# EAGLE design PS (EAGLE 7.7.0)
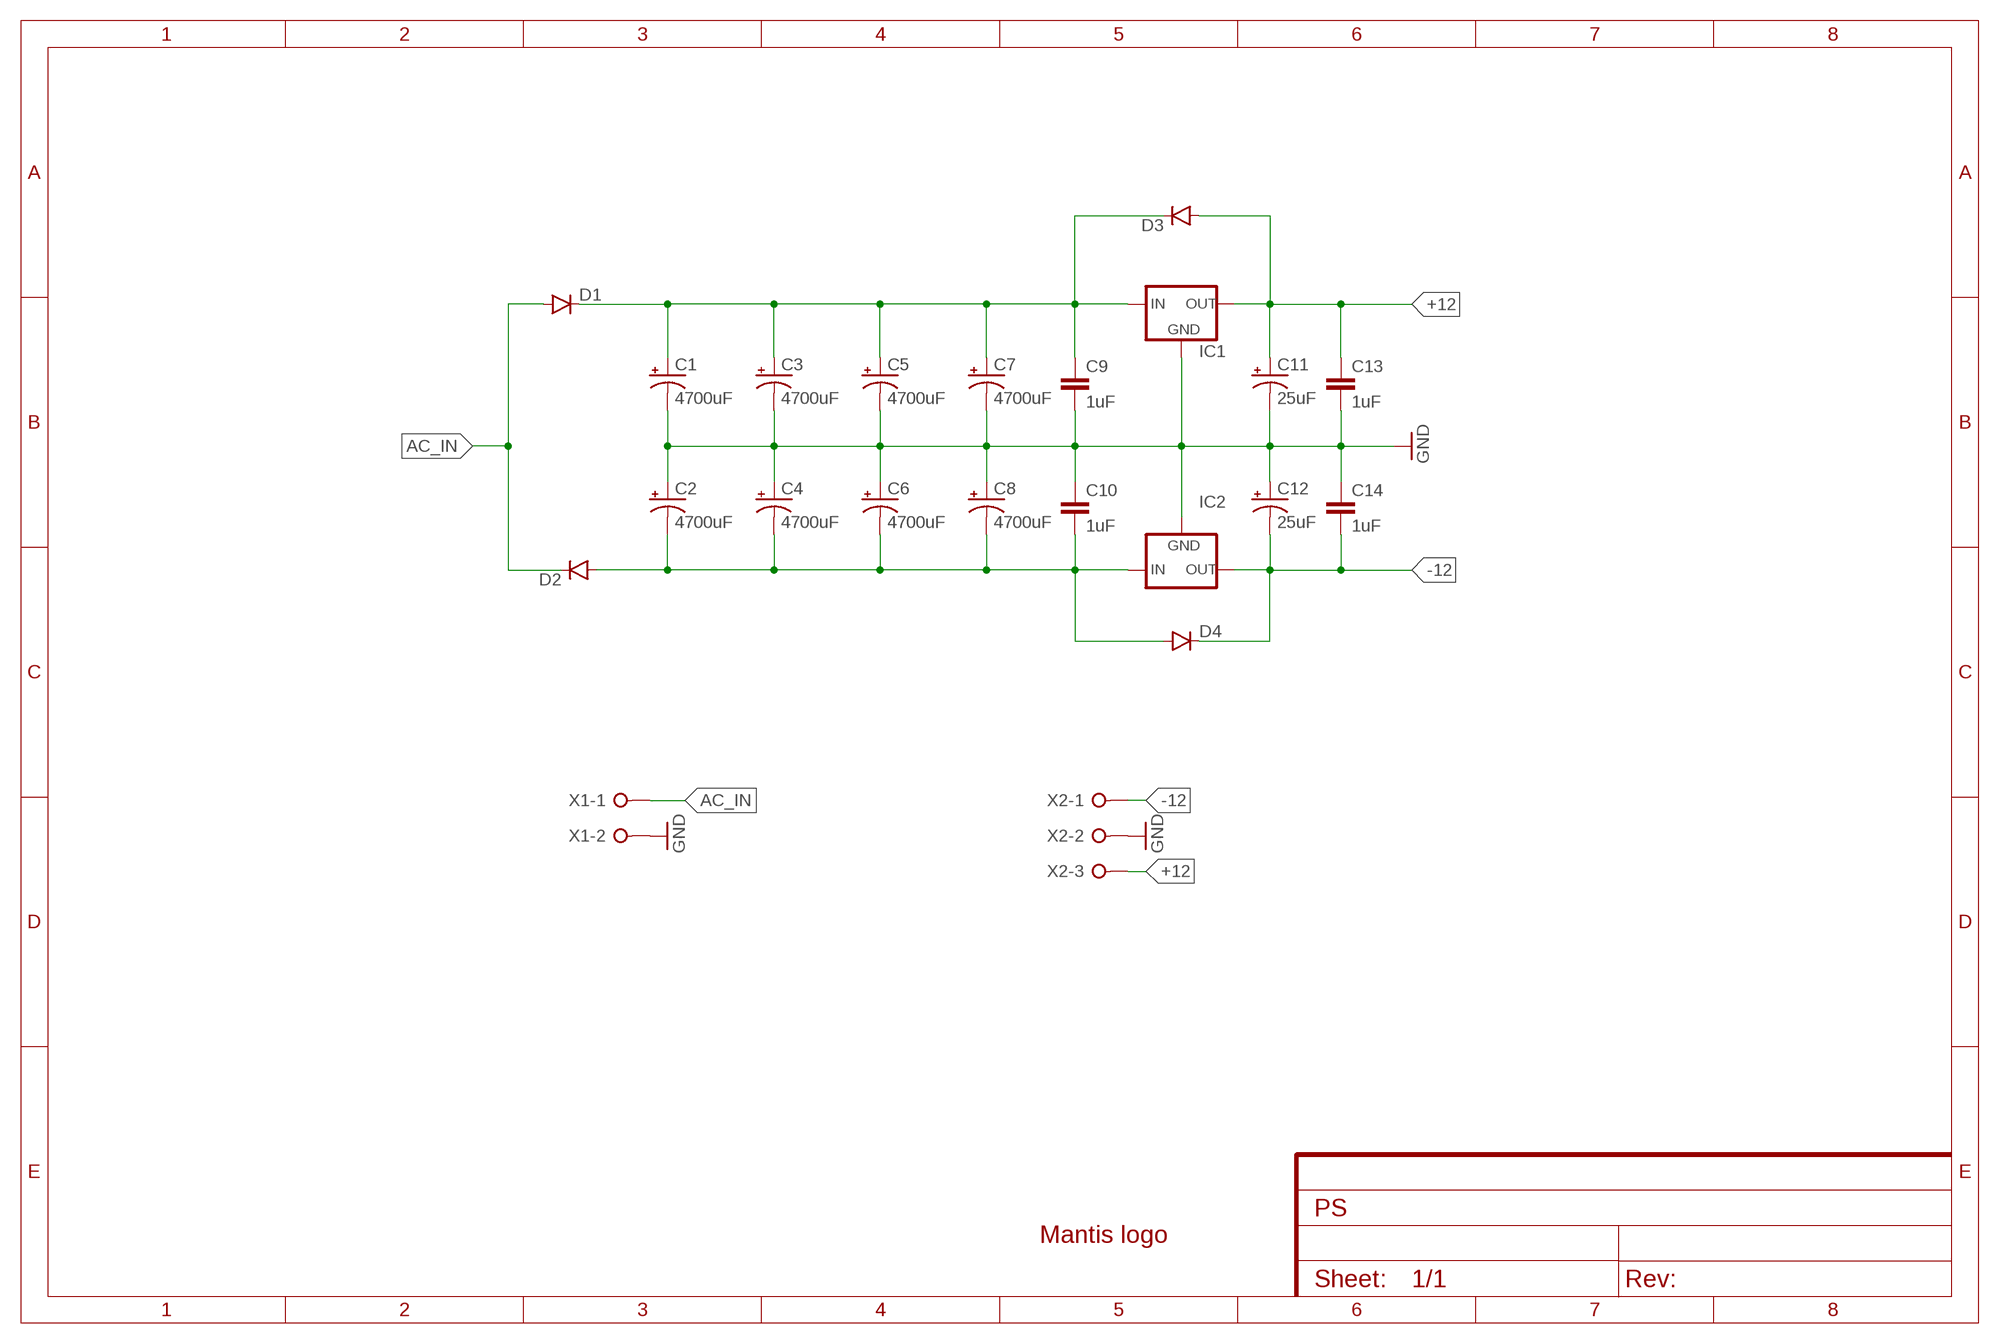
[diagram p0: schematic, sheet 1]

## Parts
C1  4700uF  CAP_POLPTH3  [CPOL-RADIAL-1000UF-63V]
C2  4700uF  CAP_POLPTH3  [CPOL-RADIAL-1000UF-63V]
C3  4700uF  CAP_POLPTH3  [CPOL-RADIAL-1000UF-63V]
C4  4700uF  CAP_POLPTH3  [CPOL-RADIAL-1000UF-63V]
C5  4700uF  CAP_POLPTH3  [CPOL-RADIAL-1000UF-63V]
C6  4700uF  CAP_POLPTH3  [CPOL-RADIAL-1000UF-63V]
C7  4700uF  CAP_POLPTH3  [CPOL-RADIAL-1000UF-63V]
C8  4700uF  CAP_POLPTH3  [CPOL-RADIAL-1000UF-63V]
C9  1uF  CAPPTH  [CAP-PTH-SMALL]
C10  1uF  CAPPTH  [CAP-PTH-SMALL]
C11  25uF  CAP_POLPTH2  [CPOL-RADIAL-10UF-25V]
C12  25uF  CAP_POLPTH2  [CPOL-RADIAL-10UF-25V]
C13  1uF  CAPPTH  [CAP-PTH-SMALL]
C14  1uF  CAPPTH  [CAP-PTH-SMALL]
D1  DIODEPTH  [DIODE-1N4001]
D2  DIODEPTH  [DIODE-1N4001]
D3  DIODEPTH  [DIODE-1N4001]
D4  DIODEPTH  [DIODE-1N4001]
IC1  78XXL  [78XXL]
IC2  79XXL  [79XXL]
LOGO1  LOGO-MANTIS  [LOGO-MANTIS]
X1  W237-02P  [W237-132]
X2  W237-3E  [W237-3E]

## Nets
+12: C11.1(+) C13.1 D3.A IC1.OUT X2.3
-12: C12.2(-) C14.2 D4.C IC2.OUT X2.1
AC_IN: D1.A D2.C X1.1
GND: C1.2(-) C2.1(+) C3.2(-) C4.1(+) C5.2(-) C6.1(+) C7.2(-) C8.1(+) C9.2 C10.1 C11.2(-) C12.1(+) C13.2 C14.1 IC1.GND IC2.GND X1.2 X2.2
R+: C1.1(+) C3.1(+) C5.1(+) C7.1(+) C9.1 D1.C D3.C IC1.IN
R-: C2.2(-) C4.2(-) C6.2(-) C8.2(-) C10.2 D2.A D4.A IC2.IN

## Library data of the parts
C1-C8 C11 C12 = SparkFun-Capacitors:CAP_POL: Capacitor Polarized These are standard SMD and PTH capacitors. Normally 10uF, 47uF, and 100uF in electrolytic and tantalum varieties. Always verify the external diameter of the through hole cap, it varies with capacity, voltage, and manufacturer. The EIA devices should be standard.
C9 C10 C13 C14 = SparkFun-Capacitors:CAP: Capacitor Standard 0603 ceramic capacitor, and 0.1" leaded capacitor.
D1-D4 = SparkFun-DiscreteSemi:DIODE: Diode These are standard reverse protection diodes and small signal diodes. SMA package can handle up to about 1A. SOD-323 can handle about 200mA. What the SOD-323 package when ordering, there are some mfgs out there that are 5-pin packages.
IC1 = v-reg:78XXL: VOLTAGE REGULATOR
IC2 = v-reg:79XXL: VOLTAGE REGULATOR
LOGO1 = my:LOGO-MANTIS: Mantis logo
X1 = con-wago-508:W237-02P: WAGO SREW CLAMP; OC_FARNELL: unknown; OC_NEWARK: unknown
X2 = con-wago-508:W237-3E: WAGO SREW CLAMP; OC_FARNELL: unknown; OC_NEWARK: unknown

## Board
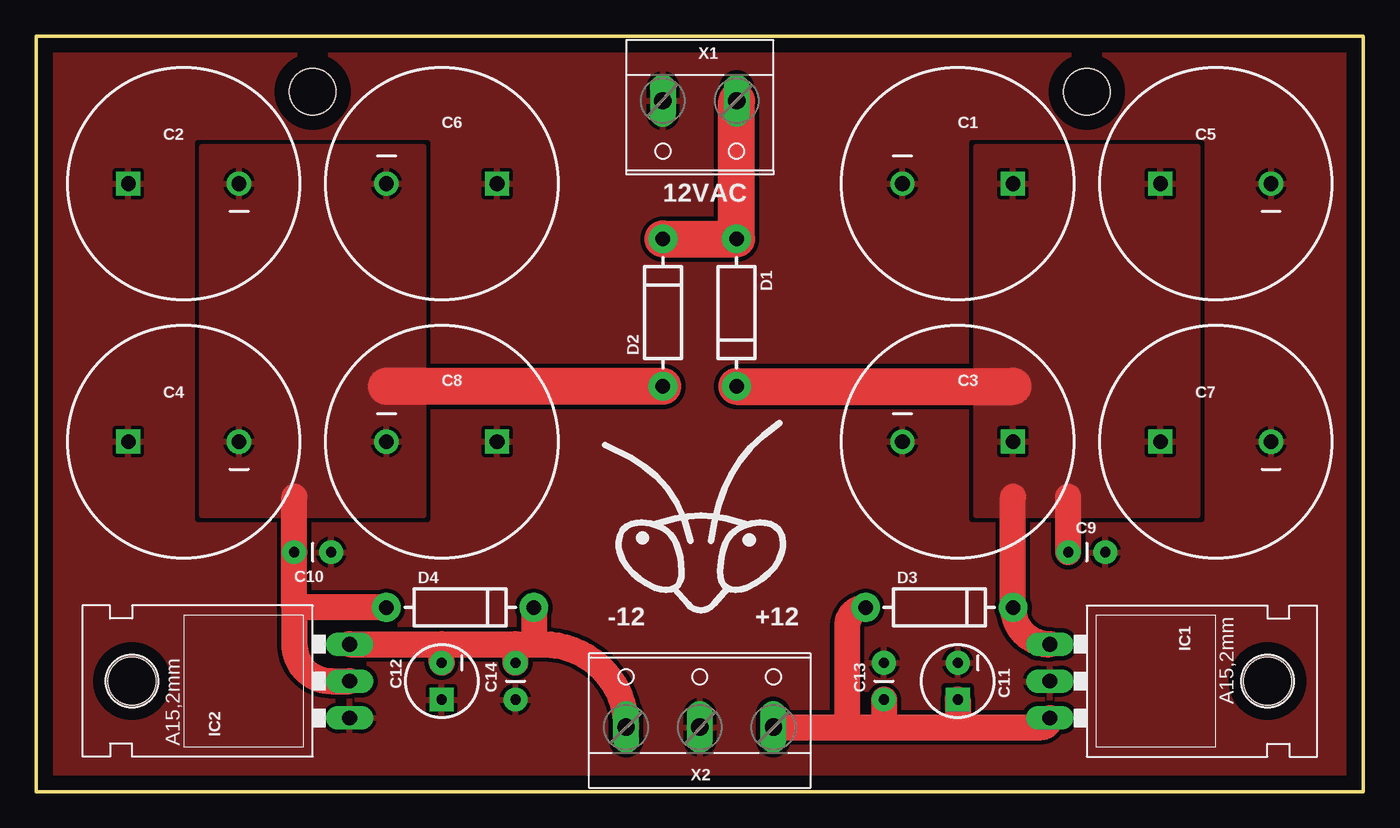
[diagram p1: board, top side]
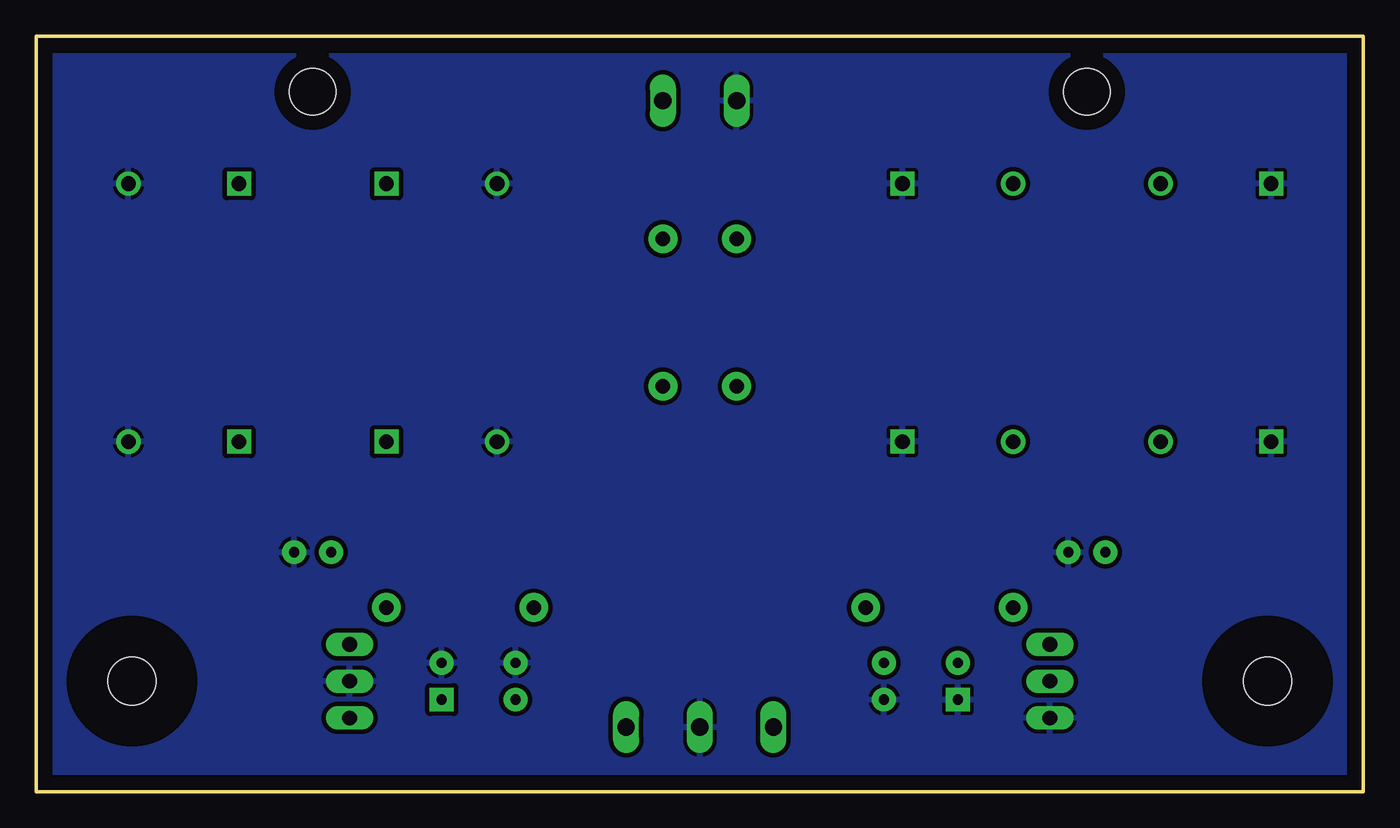
[diagram p2: board, bottom side, seen from below]

Size 91.44 x 52.07 mm. Coordinates in mm from the lower left corner, seen from the top.
Outline: 0,0 91.44,0 91.44,52.07 0,52.07 0,0
Copper layers (1*16): Top 0.035mm / dielectric 1.5mm / Bottom 0.035mm
Design rules "default *": minimum track width 12mil, minimum drill 22mil, track to track 12mil, track to pad 12mil, pad to pad 8mil, via to via 8mil, smd to smd 0mil, copper to edge 40mil, drill to drill 12mil, minimum pad ring 12mil, minimum via ring 10mil, stop-mask expansion 4mil, vias tented up to drill 0mil, thermal gap 10mil
Holes 3.2 mm at 19.05,48.26 72.39,48.26

### Footprints (pad centres in the part's own frame; a part is rotated, then mirrored left to right if it is on the bottom)
CPOL-RADIAL-1000UF-63V = drill 1.016 pad 1.651 square: 1 3.81,0 | drill 1.016 pad 1.676: 2 -3.81,0
CAP-PTH-SMALL = drill 0.7 pad 1.651: 1 0,0; 2 2.54,0
CPOL-RADIAL-10UF-25V = drill 0.7 pad 1.651 square: 1 1.27,0 | drill 0.7 pad 1.651: 2 -1.27,0
DIODE-1N4001 = drill 1 pad 1.981: A -5.08,0; C 5.08,0
78XXL = drill 1.016 long: GND 0,-3.81; IN -2.54,-3.81; OUT 2.54,-3.81 | hole 3.302: 0,11.176
79XXL = drill 1.016 long: GND -2.54,-3.81; IN 0,-3.81; OUT 2.54,-3.81 | hole 3.302: 0,11.176
W237-132 = drill 1.194 long: 1 -2.54,-0.635; 2 2.54,-0.635
W237-3E = drill 1.194 long: 1 -5.08,-0.635; 2 0,-0.635; 3 5.08,-0.635

### Placement (x,y rotation side)
C1  63.5,41.91 0 top
C2  10.16,41.91 180 top
C3  63.5,24.13 0 top
C4  10.16,24.13 180 top
C5  81.28,41.91 180 top
C6  27.94,41.91 0 top
C7  81.28,24.13 180 top
C8  27.94,24.13 0 top
C9  71.12,16.51 0 top
C10  20.32,16.51 180 top
C11  63.5,7.62 270 top
C12  27.94,7.62 270 top
C13  58.42,6.35 90 top
C14  33.02,6.35 90 top
D1  48.26,33.02 270 top
D2  43.18,33.02 90 top
D3  62.23,12.7 0 top
D4  29.21,12.7 0 top
IC1  73.66,7.62 270 top
IC2  17.78,7.62 90 top
LOGO1  45.72,19.05 0 top
X1  45.72,46.99 180 top
X2  45.72,5.08 0 top

### Tracks (layer width: path | path; a pad name or v marks a point on that pad's centre or on a via)
+12
  Top 1.778: X2.3 55.88,4.45 | 55.88,4.45 58.42,4.45 | 58.42,4.45 63.5,4.45 | 63.5,4.45 69.22,4.45 arc90 IC1.OUT | C11.1 63.5,4.45 | C13.1 58.42,4.45 | D3.A arc90 55.88,11.43 55.88,4.45
-12
  Top 1.778: IC2.OUT 27.94,10.16 | 27.94,10.16 33.02,10.16 | 33.02,10.16 34.29,10.16 | 34.29,10.16 34.92,10.16 arc-90 X2.1 | C12.2 27.94,10.16 | C14.2 33.02,10.16 | D4.C 34.29,10.16
AC_IN
  Top 2.54: D2.C D1.A X1.1
GND
  pour Top (isolate 0.305, rank 2): 0,52.07 91.44,52.07 91.44,0 0,0
  pour Bottom (isolate 0.305): 0,52.07 91.44,52.07 91.44,0 0,0
R+
  Top 1.778: IC1.IN arc-90 D3.C 67.31,20.32 | C9.1 71.12,20.32
  Top 2.54: D1.C 67.31,27.94
  pour Top: 64.77,44.45 80.01,44.45 80.01,19.05 64.77,19.05
R-
  Top 1.778: 17.78,12.7 17.78,10.16 arc90 20.32,7.62 IC2.IN | D4.A 17.78,12.7 | 17.78,12.7 C10.2 17.78,20.32
  Top 2.54: D2.A 24.13,27.94
  pour Top: 11.43,44.45 26.67,44.45 26.67,19.05 11.43,19.05

### Text on the board
tPlace: 12VAC | -12 | +12